# Altium schematic sheet RS485.SchDoc: RS485
size A; DrawnBy: Brent; DocumentNumber: XXXXXX; Revision: A; SheetNumber: 6; SheetTotal: 8
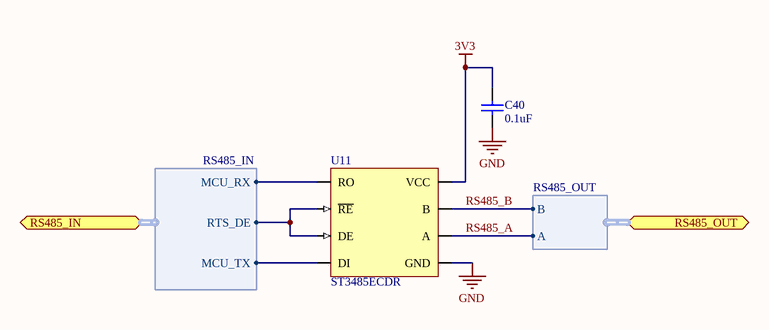
[diagram p0: RS485.SchDoc]

## Parts
C40  0.1uF  [CAPC0603(1608)100_L]
U11  ST3485ECDR  [SOIC-8]

## Ports
RS485_IN (harness RS485_IN), RS485_OUT (harness RS485_OUT)

## Harnesses
RS485_IN: MCU_RX, MCU_TX, RTS_DE
RS485_OUT: A, B

## Nets
3V3: C40.2 U11.8(VCC)
GND: C40.1 U11.5(GND)
RS485_A: U11.6(A) ; port RS485_OUT.A
RS485_B: U11.7(B) ; port RS485_OUT.B
NetU11_1: U11.1(RO) ; port RS485_IN.MCU_RX
NetU11_2: U11.2(~{RE}) U11.3(DE) ; port RS485_IN.RTS_DE
NetU11_4: U11.4(DI) ; port RS485_IN.MCU_TX

## Library data of the parts
C40 = CMP-1035-02595-1: CAP 100nF 100V ±10% 0603 (1608 Metric) Thickness 1mm SMD; Tolerance: Â±10%; Case-EIA: 0603; Case-Metric: 1608; Rated Voltage: 100 V; Value: 100nF; Technology: SMT; Max Thickness: 1 mm
U11 = ST3485ECDR: 3.3 V powered, 15 kV ESD protected, up to 12 Mbps RS-485/  RS-422 transceiver 0 to 70; Manufacturer: STMicroelectronics; Mounting Technology: Surface Mount; PackageReference: SOIC-8; PackageDescription: SOIC-8; PartNumber: ST3485ECDR